# Altium schematic sheet 02.SchDoc
size 386 x 246 mm
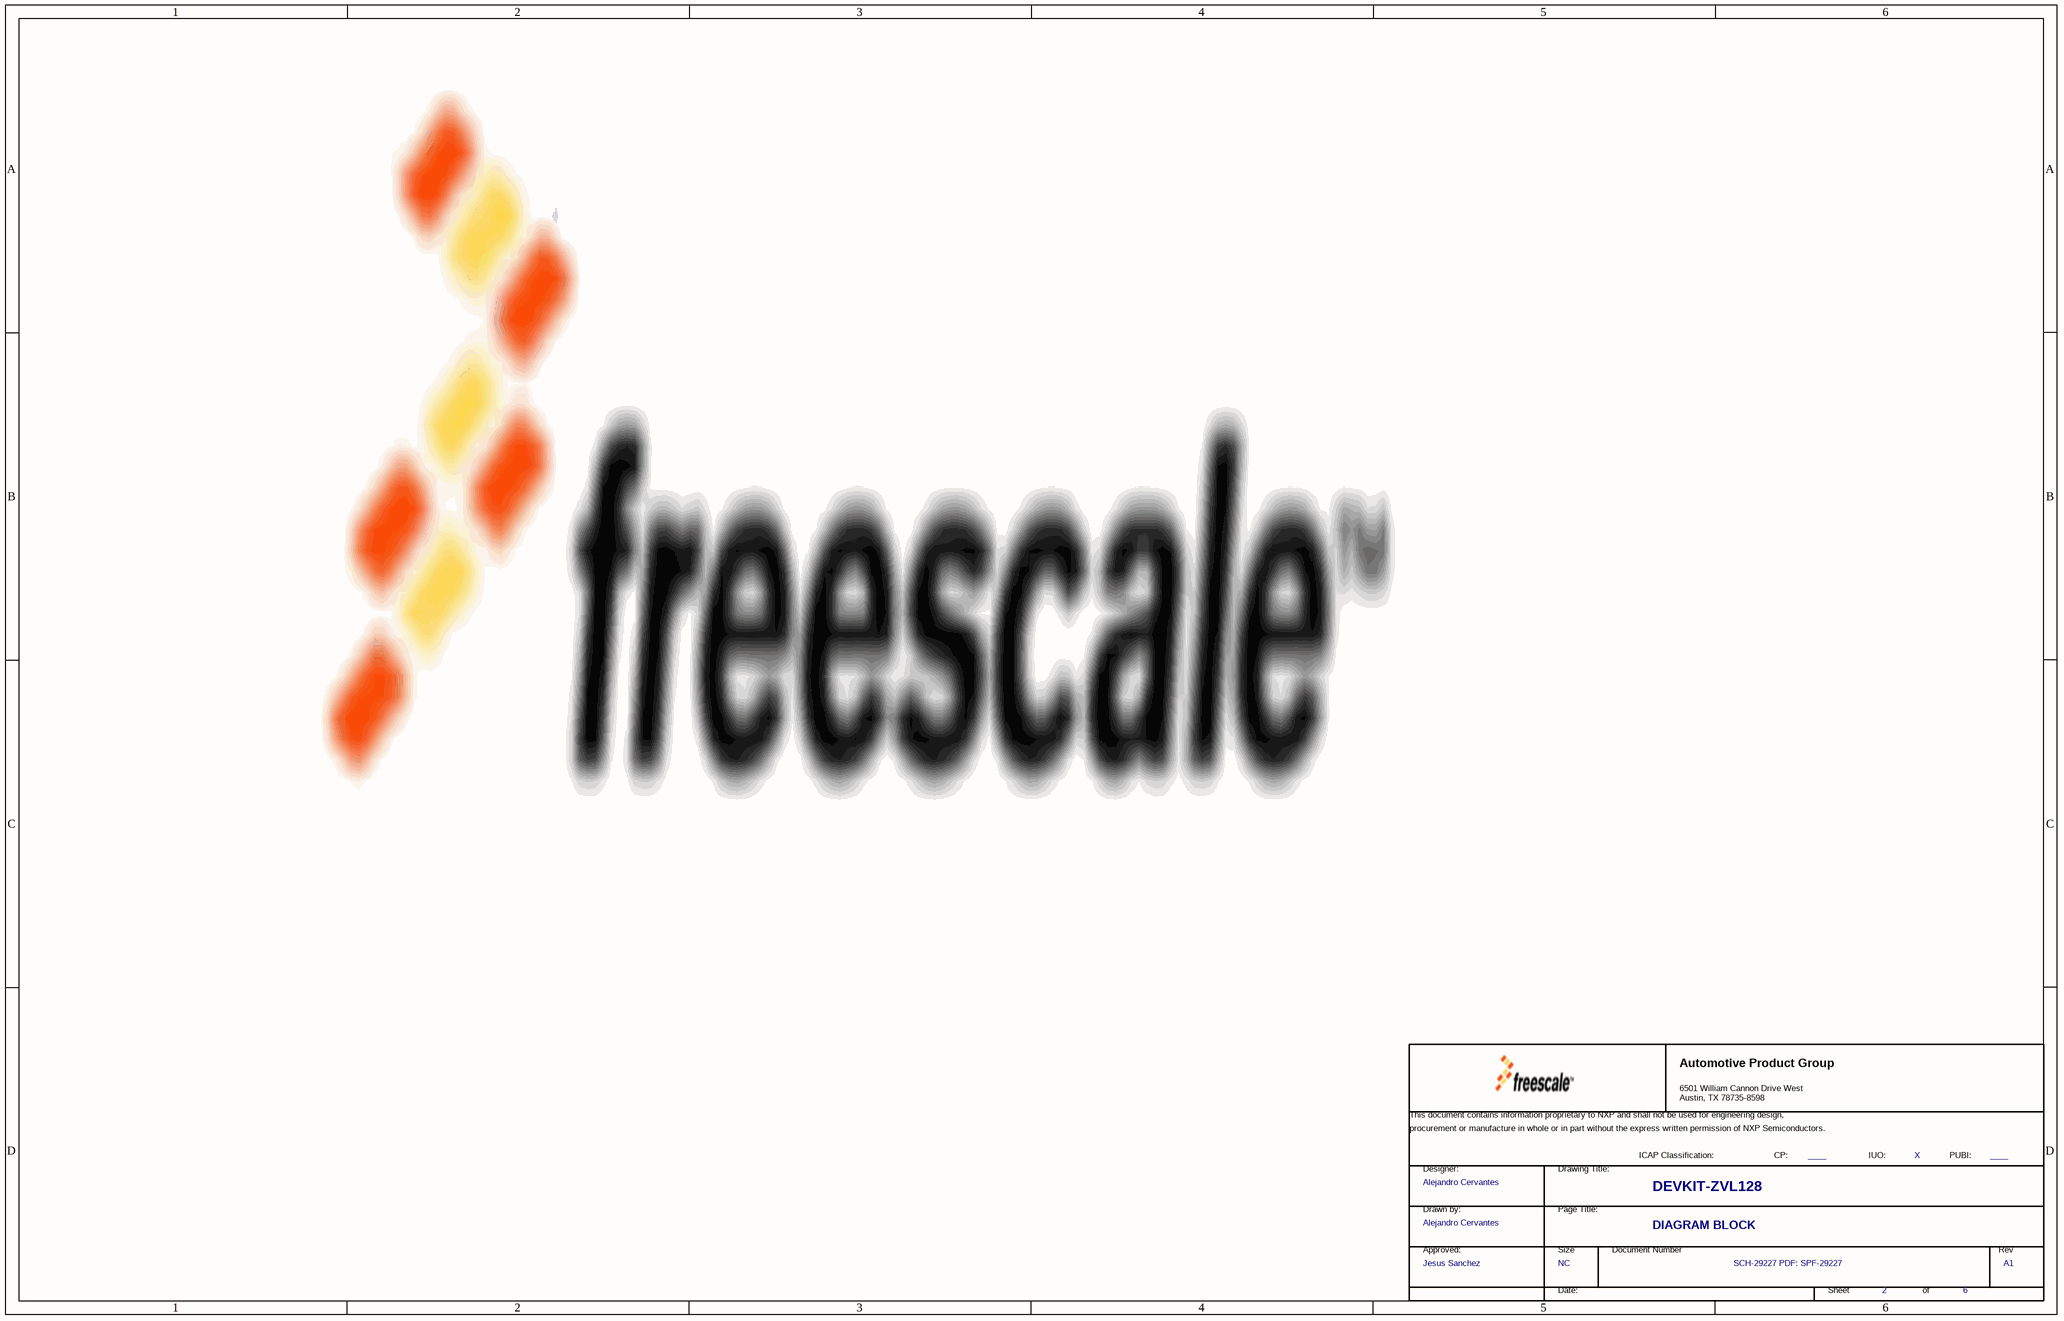
[diagram p0: 02.SchDoc]

## Parts
*  FCP: ____  FIUO: X  DrawnBy: Alejandro Cervantes  Approver: Jesus Sanchez  PageTitle: DIAGRAM BLOCK  Page Count: 6  Page Number: 2  Page Size: NC  Title: DEVKIT-ZVL128  RevCode: A1  Doc: SCH-29227 PDF: SPF-29227  (hidden comment: TitleBlock_AMPG)  (graphical)

## Notes on the sheet
- (in symbol TitleBlock_AMPG) Automotive Product Group; 6501 William Cannon Drive West / Austin, TX 78735-8598; This document contains information proprietary to NXP and shall not be used for engineering design,; procurement or manufacture in whole or in part without the express written permission of NXP Semiconductors.; ICAP Classification:; CP:; IUO:; PUBI:; Designer:; Drawing Title:; Drawn by:; Page Title:; Approved:; Size; Document Number; Rev; Date:; Sheet; of

## Library data of the parts
* = TitleBlock_AMPG: OrgName: Freescale Semiconductor; OrgAddr1: 6501 William Cannon Drive West; OrgAddr2: Austin, TX 78735-8598; PUBI: ____; Designer: Alejandro Cervantes; Page Create Date: March  8, 1995